# EAGLE design ARTSi-v5 (EAGLE 9.5.2)
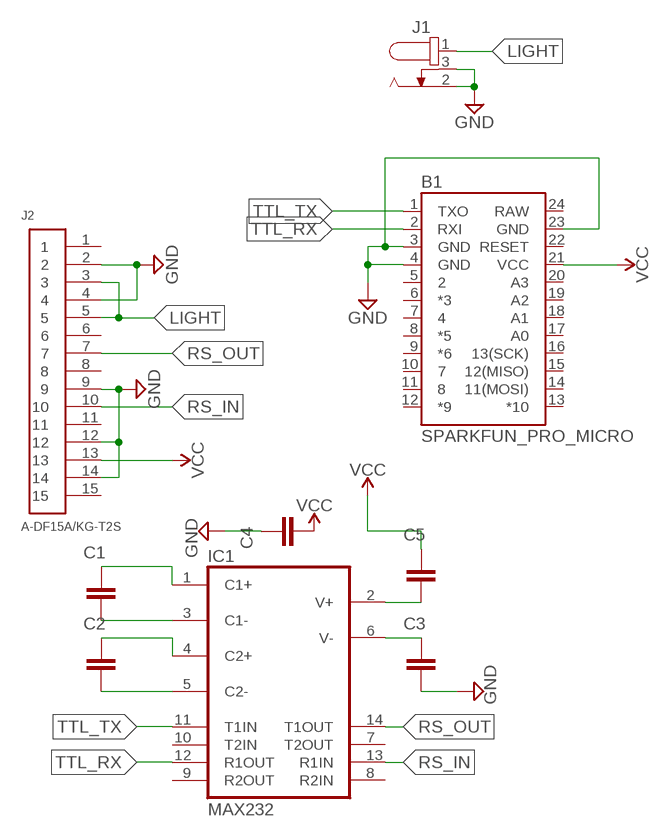
[diagram p0: schematic, sheet 1]

## Parts
B1  SPARKFUN_PRO_MICRO  [SPARKFUN_PRO_MICRO]
C1  CC0805KRX7R9BB104  [CAP_0805]
C2  CC0805KRX7R9BB104  [CAP_0805]
C3  CC0805KRX7R9BB104  [CAP_0805]
C4  CC0805KRX7R9BB104  [CAP_0805]
C5  CC0805KRX7R9BB104  [CAP_0805]
IC1  MAX232  [DIL16]
J1  694108301002  [694108301002]
J2  A-DF15A/KG-T2S  [A-DF15A/KG-T2S]

## Nets
GND: B1.3(GND) B1.4(GND) B1.23(GND) C3.2 C4.1 J1.2 J1.3 J2.2 J2.4 J2.9 J2.12 J2.14
LIGHT: J1.1 J2.3 J2.5
N$1: C1.2 IC1.3(C1-)
N$2: C2.1 IC1.4(C2+)
N$3: C2.2 IC1.5(C2-)
N$4: C1.1 IC1.1(C1+)
N$5: C5.2 IC1.2(V+)
N$6: C3.1 IC1.6(V-)
RS_IN: IC1.13(R1IN) J2.10
RS_OUT: IC1.14(T1OUT) J2.7
TTL_RX: B1.2(RXI) IC1.12(R1OUT)
TTL_TX: B1.1(TXO) IC1.11(T1IN)
VCC: B1.21(VCC) C4.2 C5.1 J2.13
Unconnected: B1.5 B1.6(*3) B1.7 B1.8(*5) B1.9(*6) B1.10 B1.11 B1.12(*9) B1.13(*10) B1.14(11(MOSI)) B1.15(12(MISO)) B1.16(13(SCK)) B1.17(A0) B1.18(A1) B1.19(A2) B1.20(A3) B1.22(RESET) IC1.7(T2OUT) IC1.8(R2IN) IC1.9(R2OUT) IC1.10(T2IN) J2.1 J2.6 J2.8 J2.11 J2.15

## Power pins joined to a net without a drawn wire
GND: IC1.15(GND)
RAW: B1.24(RAW)
VCC: IC1.16(VCC)

## Library data of the parts
B1 = SparkFun-Boards:SPARKFUN_PRO_MICRO: SparkFun Pro Micro Atmega32U4 compatible footprint. SparkFun Products: 3.3V/8MHz <https://www.sparkfun.com/products/12587> 5V/16MHz <https://www.sparkfun.com/products/12640>
C1-C5 = Resistor_Capacitor:CC0805KRX7R9BB104: CAP CER 0.1UF 50V X7R 0805 Manufacturer's datasheet <http://www.yageo.com/documents/recent/UPY-GPHC_X7R_6.3V-to-50V_18.pdf>; CREATED_BY: PCBLayout.com; DIGIKEY_PART_NUMBER: 311-1140-2-ND; MANUFACTURER: Yageo; MPN: CC0805KRX7R9BB104; PACKAGE: SMD 0805
IC1 = maxim:MAX232: RS232 TRANSCEIVER; MF: MAXIM; MPN: MAX232ACPE+; OC_FARNELL: 9723773; OC_NEWARK: 68K4544
J1 = Wurth_Connectors_WR-DC:694108301002: WR-DC DC Power Jack Right Angled (6.4) KIND PROPERTIES Quality Class 5 000 Mating cycles Type Right Angled MATERIAL PROPERTIES Insulator Material PA66 Insulator Flammability Rating UL94 V-0 Color Black Contact Material Copper Alloy Contact Type Stamped Center Pin Plating Gold Center Pin Terminal Plating Tin Tip Spring Material Tin Shunt Terminal Plating Tin GENERAL INFORMATION Operating Temperature -40 up to +85 °C Compliance RoHS ELECTRICAL PROPERTIES IR 1 5 A Working Voltage 30 V (AC) Withstanding Voltage 500 V (AC) Contact Resistance 50 mΩ RISO 100 MΩ PACKAGING PROPERTIES Packaging Bag <https://katalog.we-online.com/media/images/v2/o59009v209%20Family_WR-DC_DC_Power_Jack_Right_Angled_THT_69410x301002.jpg> Details see: https://katalog.we-online.com/en/em/DC_RIGHT_ANGLED_6_4_69410X301002 Updated by Ella Wu 2019-11-01 2019(C) Wurth Elektronik; DATASHEET-URL: https://katalog.we-online.com/em/datasheet/694108301002.pdf; IR: 5A; MOUNT: THT; PART-NUMBER: 694108301002; TYPE: Right Angled; WORKING-VOLTAGE: 30V(AC)
J2 = D-Sub Connectors:A-DF15A/KG-T2S: CONN D-SUB RCPT 15POS R/A SOLDER Manufacturer's datasheet <http://www.assmann-wsw.com/fileadmin/datasheets/ASS_4888_CO.pdf>; CREATED_BY: PCBLayout.com; DIGI_KEY_PART_NUMBER: AE10929-ND; MANUFACTURER: Assmann WSW Components; MPN: A-DF 15 A/KG-T2S

## Board
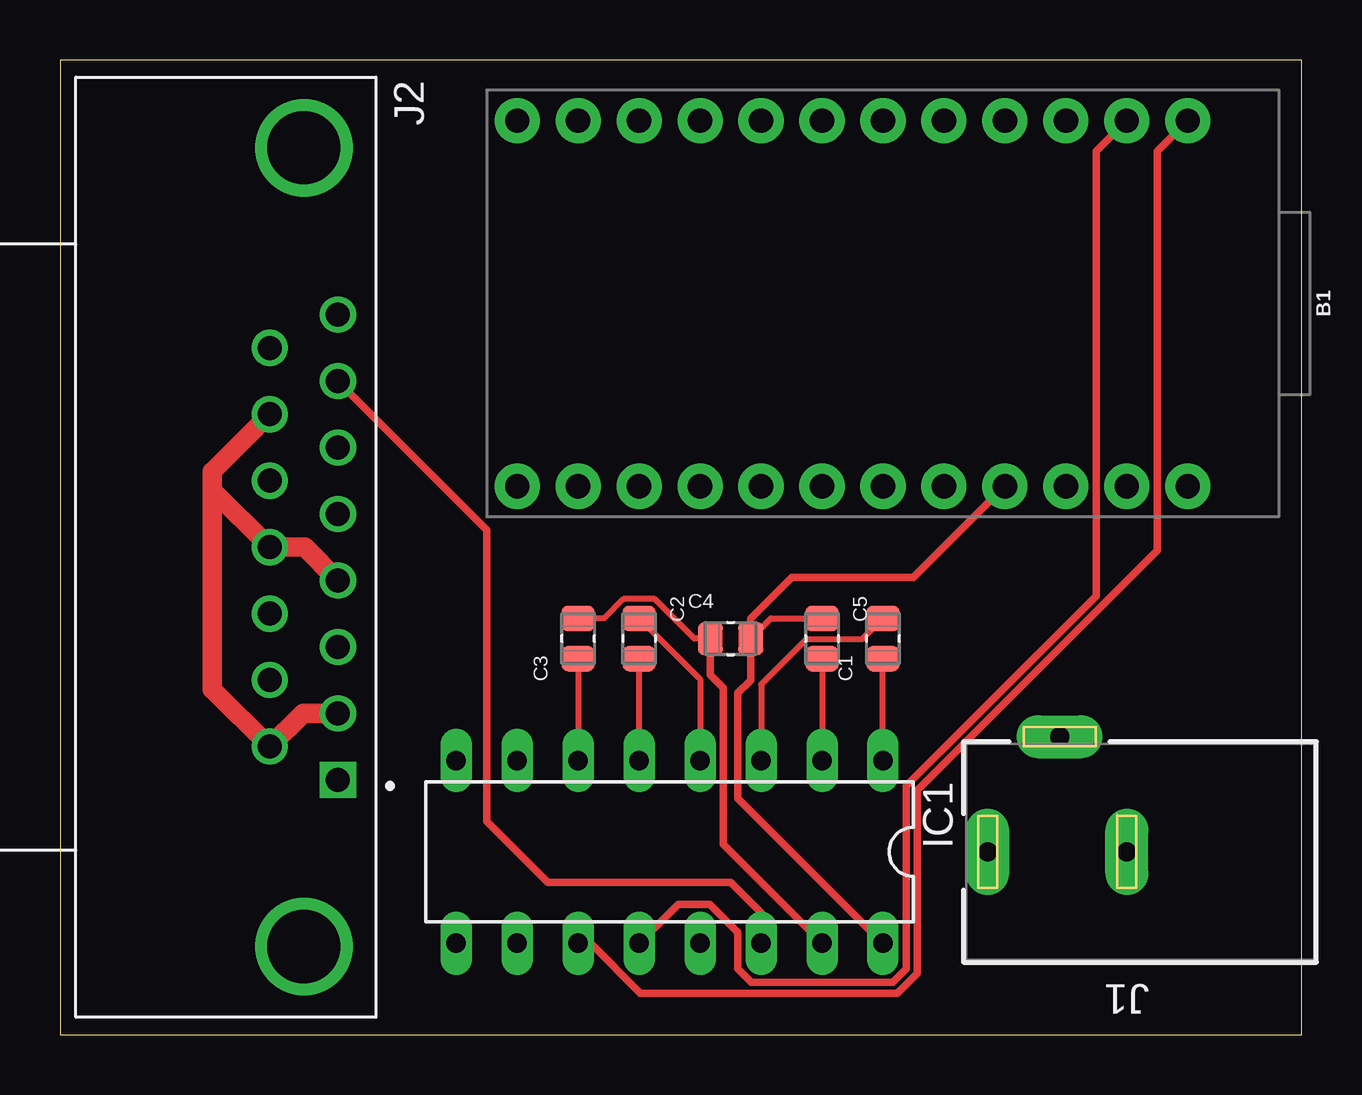
[diagram p1: board, top side]
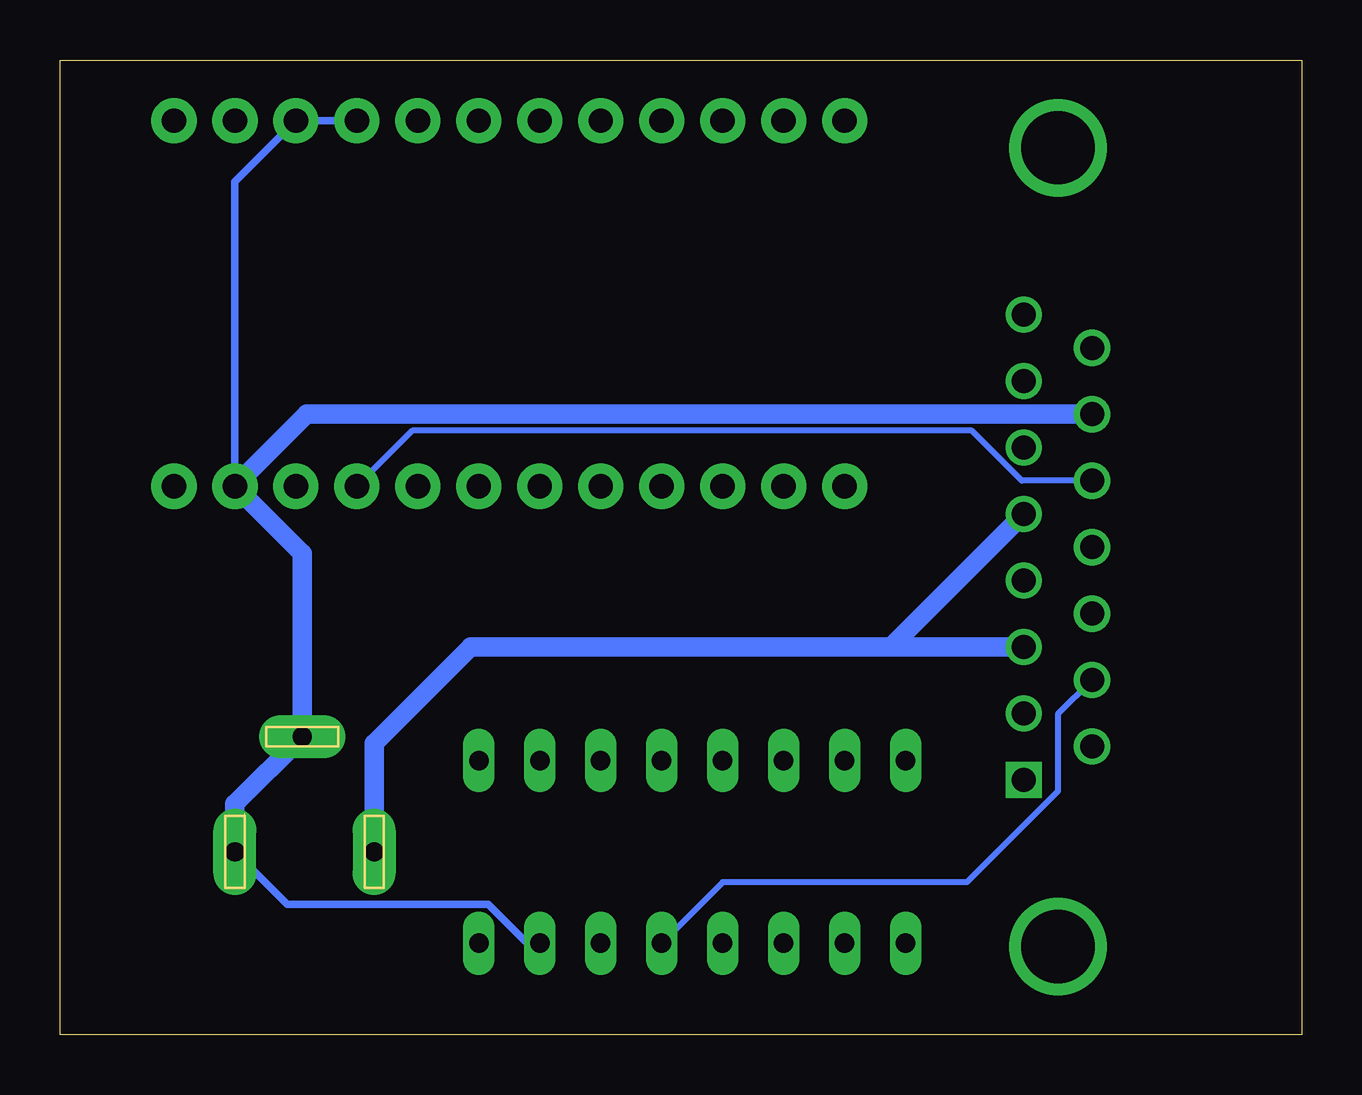
[diagram p2: board, bottom side, seen from below]

Size 51.74 x 40.63 mm. Coordinates in mm from the lower left corner, seen from the top.
Outline: 0,0 51.74,0 51.74,40.63 0,40.63 0,0
Copper layers (1*16): Top 0.035mm / dielectric 1.5mm / Bottom 0.035mm
Design rules "default": minimum track width 6mil, minimum drill 0.35mm, track to track 6mil, track to pad 6mil, pad to pad 6mil, via to via 6mil, smd to smd 6mil, copper to edge 40mil, drill to drill 6mil, minimum pad ring 10mil, minimum via ring 8mil, stop-mask expansion 4mil, vias tented up to drill 0mil, thermal gap 10mil

### Footprints (pad centres in the part's own frame; a part is rotated, then mirrored left to right if it is on the bottom)
SPARKFUN_PRO_MICRO = drill 1.016 pad 1.88: 1 -7.62,12.7; 2 -7.62,10.16; 3 -7.62,7.62; 4 -7.62,5.08; 5 -7.62,2.54; 6 -7.62,0; 7 -7.62,-2.54; 8 -7.62,-5.08; 9 -7.62,-7.62; 10 -7.62,-10.16; 11 -7.62,-12.7; 12 -7.62,-15.24; 13 7.62,-15.24; 14 7.62,-12.7; 15 7.62,-10.16; 16 7.62,-7.62; 17 7.62,-5.08; 18 7.62,-2.54; 19 7.62,0; 20 7.62,2.54; 21 7.62,5.08; 22 7.62,7.62; 23 7.62,10.16; 24 7.62,12.7
CAP_0805 = smd 1.05 x 1.38: 1 -0.84,0; 2 0.84,0
DIL16 = drill 0.813 long: 1 -8.89,-3.81; 2 -6.35,-3.81; 3 -3.81,-3.81; 4 -1.27,-3.81; 5 1.27,-3.81; 6 3.81,-3.81; 7 6.35,-3.81; 8 8.89,-3.81; 9 8.89,3.81; 10 6.35,3.81; 11 3.81,3.81; 12 1.27,3.81; 13 -1.27,3.81; 14 -3.81,3.81; 15 -6.35,3.81; 16 -8.89,3.81
694108301002 = drill 0.8 pad 1.8 long: 1 5.8,0; 2 0,0; 3 2.8,-4.8
A-DF15A/KG-T2S = drill 1 square: 1 9.695,1.42 | drill 1: 2 6.925,1.42; 3 4.155,1.42; 4 1.385,1.42; 5 -1.385,1.42; 6 -4.155,1.42; 7 -6.925,1.42; 8 -9.695,1.42; 9 8.31,-1.42; 10 5.54,-1.42; 11 2.77,-1.42; 12 0,-1.42; 13 -2.77,-1.42; 14 -5.54,-1.42; 15 -8.31,-1.42 | drill 3.05: P$1 16.65,0; P$2 -16.65,0

### Placement (x,y rotation side)
B1  34.29,30.48 270 top
C1  34.29,16.51 90 top
C2  24.13,16.51 270 top
C3  21.59,16.51 90 top
C4  27.94,16.51 0 top
C5  31.75,16.51 270 top
IC1  25.4,7.62 180 top
J1  44.45,7.62 180 top
J2  10.16,20.32 270 top

### Tracks (layer width: path | path; a pad name or v marks a point on that pad's centre or on a via)
GND
  Top 0.254: C4.1 26.43,16.51 24.79,18.15 23.47,18.15 22.67,17.35 C3.2
  Top 0.305: C4.1 27.1,14.99 27.64,14.46 27.64,7.92 IC1.15
  Top 0.813: J2.2 10.12,13.39 J2.9 6.35,14.4 6.35,22.71 | J2.14 6.35,23.47 6.35,22.71 | 6.35,22.71 J2.12 10.2,20.32 J2.4
  Bottom 0.305: B1.4 B1.3 44.45,35.56 B1.23 | IC1.15 32.27,3.81 33.89,5.44 42.27,5.44 J1.2
  Bottom 0.813: J1.2 44.45,9.62 J1.3 41.65,20.06 B1.23 41.45,25.86 J2.14
LIGHT
  Bottom 0.813: J1.1 38.65,12.15 34.63,16.16 17.78,16.16 17.12,16.16 | 17.12,16.16 J2.3 | J2.5 17.12,16.16
N$1
  Top 0.254: C1.2 33.41,16.47 31.09,16.47 29.21,14.59 IC1.3
N$2
  Top 0.254: C2.1 26.67,14.81 IC1.4
N$3
  Top 0.254: IC1.5 C2.2
N$4
  Top 0.254: IC1.1 C1.1
N$5
  Top 0.254: C5.2 IC1.2
N$6
  Top 0.254: C3.1 IC1.6
RS_IN
  Bottom 0.254: J2.10 10.16,13.36 10.16,10.14 13.95,6.35 24.13,6.35 IC1.13
RS_OUT
  Top 0.305: J2.7 17.78,21.05 17.78,8.89 20.32,6.35 27.94,6.35 29.21,5.08 IC1.14
TTL_RX
  Top 0.305: IC1.12 25.76,5.44 27.07,5.44 28.25,4.26 28.25,2.75 28.81,2.18 34.69,2.18 35.26,2.75 35.26,10.37 43.18,18.3 43.18,36.83 B1.2
TTL_TX
  Top 0.305: IC1.11 22.11,3.81 24.19,1.73 34.88,1.73 35.71,2.56 35.71,10.18 45.72,20.19 45.72,36.83 B1.1
VCC
  Top 0.254: C4.2 29.62,17.35 C5.1
  Top 0.305: IC1.16 28.25,9.86 28.25,14.24 28.78,14.77 C4.2 28.78,17.35 30.48,19.05 35.56,19.05 B1.21
  Bottom 0.254: J2.13 11.66,23.09 13.74,25.17 37.06,25.17 B1.21